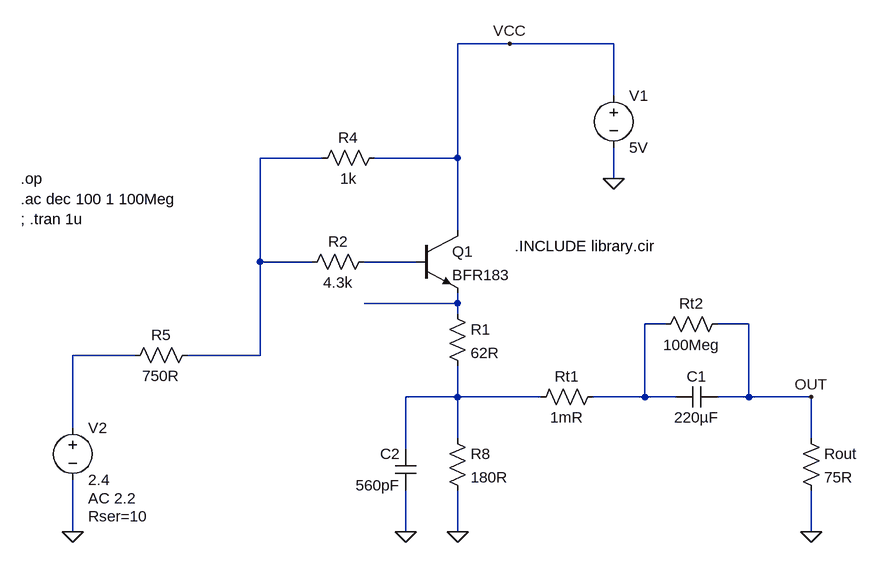
[diagram p0: schematic composite_video_LPF.asc]
composite_video_LPF.asc, the LTspice schematic file:
Version 4
SHEET 1 2784 4832
WIRE 432 -176 352 -176
WIRE 592 -176 432 -176
WIRE 592 -96 592 -176
WIRE 144 0 48 0
WIRE 352 0 352 -176
WIRE 352 0 224 0
WIRE 592 32 592 -16
WIRE 352 112 352 0
WIRE 48 160 48 0
WIRE 128 160 48 160
WIRE 288 160 208 160
WIRE 352 224 352 208
WIRE 352 224 208 224
WIRE 352 240 352 224
WIRE 672 256 640 256
WIRE 800 256 752 256
WIRE -144 304 -240 304
WIRE 48 304 48 160
WIRE 48 304 -64 304
WIRE 352 368 352 320
WIRE 352 368 272 368
WIRE 480 368 352 368
WIRE 640 368 640 256
WIRE 640 368 560 368
WIRE 688 368 640 368
WIRE 800 368 800 256
WIRE 800 368 752 368
WIRE 896 368 800 368
WIRE -240 416 -240 304
WIRE 352 432 352 368
WIRE 896 432 896 368
WIRE 272 448 272 368
WIRE -240 576 -240 496
WIRE 272 576 272 512
WIRE 352 576 352 512
WIRE 896 576 896 512
FLAG 352 576 0
FLAG 592 32 0
FLAG 432 -176 VCC
FLAG 896 576 0
FLAG 896 368 OUT
FLAG -240 576 0
FLAG 272 576 0
DATAFLAG 272 368 "round(100*$)/100"
DATAFLAG -16 304 "round(100*$)/100"
DATAFLAG 240 160 "round($*100)/100"
DATAFLAG 240 224 "round($*100)/100"
DATAFLAG -208 304 "round(100*$)/100"
SYMBOL npn 288 112 R0
SYMATTR InstName Q1
SYMATTR Value BFR183
SYMBOL res 224 144 R90
WINDOW 0 0 56 VBottom 2
WINDOW 3 32 56 VTop 2
SYMATTR InstName R2
SYMATTR Value 4.3k
SYMBOL res 128 16 R270
WINDOW 0 32 56 VTop 2
WINDOW 3 0 56 VBottom 2
SYMATTR InstName R4
SYMATTR Value 1k
SYMBOL res -48 288 R90
WINDOW 0 0 56 VBottom 2
WINDOW 3 32 56 VTop 2
SYMATTR InstName R5
SYMATTR Value 750R
SYMBOL voltage 592 -112 R0
SYMATTR InstName V1
SYMATTR Value 5V
SYMBOL res 336 224 R0
SYMATTR InstName R1
SYMATTR Value 62R
SYMBOL res 336 416 R0
SYMATTR InstName R8
SYMATTR Value 180R
SYMBOL cap 752 352 R90
WINDOW 0 0 32 VBottom 2
WINDOW 3 32 32 VTop 2
SYMATTR InstName C1
SYMATTR Value 220µF
SYMBOL res 880 416 R0
SYMATTR InstName Rout
SYMATTR Value 75R
SYMBOL res 576 352 R90
WINDOW 0 0 56 VBottom 2
WINDOW 3 32 56 VTop 2
SYMATTR InstName Rt1
SYMATTR Value 1mR
SYMBOL res 768 240 R90
WINDOW 0 0 56 VBottom 2
WINDOW 3 32 56 VTop 2
SYMATTR InstName Rt2
SYMATTR Value 100Meg
SYMBOL voltage -240 400 R0
WINDOW 123 24 124 Left 2
WINDOW 39 24 152 Left 2
SYMATTR Value2 AC 2.2
SYMATTR SpiceLine Rser=10
SYMATTR InstName V2
SYMATTR Value 2.4
SYMBOL cap 288 512 R180
WINDOW 0 24 56 Left 2
WINDOW 3 24 8 Left 2
SYMATTR InstName C2
SYMATTR Value 560pF
TEXT -320 32 Left 2 !.op\n.ac dec 100 1 100Meg\n; .tran 1u
TEXT 440 136 Left 2 !.INCLUDE library.cir

The netlist it stands for:
* composite_video_LPF.asc
Q1 VCC N002 N003 0 BFR183
R2 N002 N001 4.3k
R4 N001 VCC 1k
R5 N001 N005 750R
V1 VCC 0 5V
R1 N003 N006 62R
R8 N006 0 180R
C1 OUT N004 220µF
Rout OUT 0 75R
Rt1 N004 N006 1mR
Rt2 OUT N004 100Meg
V2 N005 0 2.4 AC 2.2 Rser=10
C2 0 N006 560pF
.model NPN NPN
.model PNP PNP
.lib standard.bjt
.op
.ac dec 100 1 100Meg
; .tran 1u
.INCLUDE library.cir
.backanno
.end